# EAGLE design SparkSwitch Small (EAGLE 9.6.2)
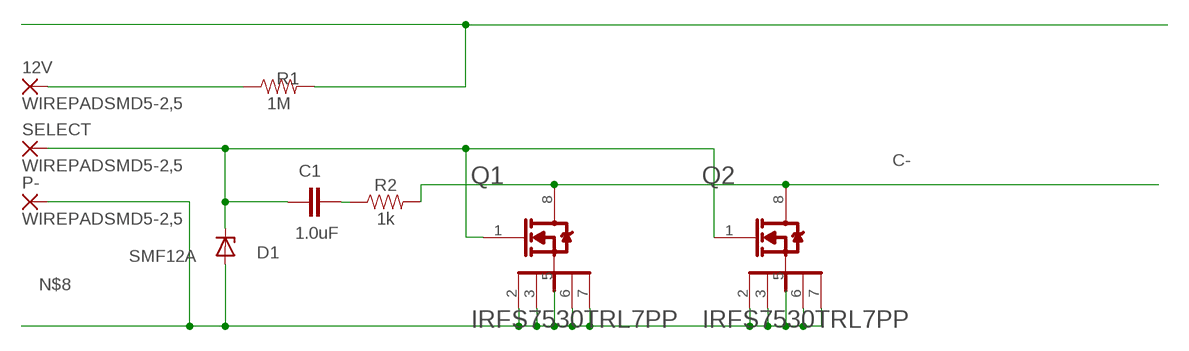
[diagram p0: schematic, sheet 1]

## Parts
12V  WIREPADSMD5-2,5  [5-2,5]
C1  1.0uF  1.0UF-0805-25V-(+80/-20%)  [0805]
D1  SMF12A  [SOD123F]
P-  WIREPADSMD5-2,5  [5-2,5]
Q1  INFINEON_IRFS7530TRL7PPINFINEON_IRFS7530TRL7PP_0_0  [INFINEON_IRFS7530TRL7PP_0]
Q2  INFINEON_IRFS7530TRL7PPINFINEON_IRFS7530TRL7PP_0_0  [INFINEON_IRFS7530TRL7PP_0]
R1  1M  1MOHM-0603-1/4W-5%  [0603]
R2  1k  1KOHM-0603-1/10W-1%  [0603]
SELECT  WIREPADSMD5-2,5  [5-2,5]

## Nets
C-: Q1.8(D) Q2.8(D) R2.2
N$3 [Therm]: C1.1 D1.C Q1.1(G) Q2.1(G) SELECT.1(P)
N$4 [Therm]: C1.2 R2.1
N$5 [Therm]: R1.2
N$6 [Therm]: 12V.1(P) R1.1
N$8 [Therm]: D1.A P-.1(P) Q1.2(1_S) Q1.3(2_S) Q1.5(3_S) Q1.6(4_S) Q1.7(5_S) Q2.2(1_S) Q2.3(2_S) Q2.5(3_S) Q2.6(4_S) Q2.7(5_S)

## Library data of the parts
12V P- SELECT = wirepad:WIREPAD: Wire PAD connect wire on PCB
C1 = SparkFun-Capacitors:1.0UF: 1µF ceramic capacitors A capacitor is a passive two-terminal electrical component used to store electrical energy temporarily in an electric field.; PROD_ID: CAP-11625
D1 = smf_10:SMF*A: SMF Series TVS Diodes Source: http://www.littelfuse.com/~/media/electronics/datasheets/tvs_diodes/littelfuse_tvs_diode_smf_datasheet.pdf.pdf; MF: Littelfuse; MPN: SMF12A; OC_FARNELL: unknown; OC_NEWARK: unknown
Q1 Q2 = Infineon - IRFS7530TRL7PP:INFINEON_IRFS7530TRL7PP: N-Channel 60V 240A (Tc) 375W (Tc) Surface Mount D2PAK (7-Lead); AUTOMOTIVE: No; CENTROID_NOT_SPECIFIED: Yes; CONTINUOUS_DRAIN_CURRENT: 240A; DATASHEET: https://www.infineon.com/dgdl/irfs7530-7ppbf.pdf?fileId=5546d462533600a40153563a9d1e21d8; DEPLETION_MODE: False; DEVICE_CLASS_L1: Discrete Semiconductors; DEVICE_CLASS_L2: Transistors; DEVICE_CLASS_L3: MOSFETs; DIGIKEY_DESCRIPTION: MOSFET N CH 60V 240A D2PAK; DIGIKEY_PART_NUMBER: IRFS7530TRL7PPCT-ND; DRAIN_TO_SOURCE_BREAKDOWN_VOLTAGE: 60V; DRAIN_TO_SOURCE_RESISTANCE: 1.15mΩ; DRAIN_TO_SOURCE_VOLTAGE: 60V; FOOTPRINT_URL: https://www.infineon.com/cms/en/product/packages/PG-TO263/PG-TO263-7-900/; FOOTPRINT_VARIANT_NAME_0: Recommended_Land_Pattern; GATE_CHARGE_AT_VGS: 236nC @ 10V; GATE_TO_SOURCE_VOLTAGE: 20V; HEIGHT: 5.084mm; INPUT_CAPACITACE_AT_VDS: 12960pF @ 25V; LEAD_FREE: Yes; MAX_FORWARD_DIODE_VOLTAGE: 1.2V; MAX_JUNCTION_TEMP: +175°C; MF: Infineon; MFG_PACKAGE_IDENT: PG-TO263-7; MFG_PACKAGE_IDENT_COMPONENT_ID: 97dda32f29e91852; MFG_PACKAGE_IDENT_DATE: 0; MFG_PACKAGE_IDENT_REV: 900; MOUSER_PART_NUMBER: 942-IRFS7530TRL7PP; MPN: IRFS7530TRL7PP; NUMBER_OF_CHANNELS: 1; NUMBER_OF_N_CHANNELS: 1; PACKAGE: D2PAK7P; POWER_DISSIPATION: 375W; PREFIX: Q; PULSE_DRAIN_CURRENT: 1450A; REVERSE_RECOVERY_CHARGE: 72nC; REVERSE_RECOVERY_TIME: 48ns; ROHS: Yes; RTHJA_MAX: 40°C/W; STANDOFF_HEIGHT: 0mm; TECHNOLOGY: MOSFET; TEMPERATURE_RANGE_HIGH: +175°C; TEMPERATURE_RANGE_LOW: -55°C; THRESHOLD_VGS: 2.1-3.7V; THRESHOLD_VGS_MAX: 3.7V; THRESHOLD_VGS_MIN: 2.1V; TURN_OFF_DELAY_TIME: 168ns; TURN_ON_DELAY_TIME: 24ns; VERIFICATION_VERSION: 0.0.0.3
R1 = SparkFun-Resistors:1MOHM: 1MΩ resistor A resistor is a passive two-terminal electrical component that implements electrical resistance as a circuit element. Resistors act to reduce current flow, and, at the same time, act to lower voltage levels within circuits. - Wikipedia; PROD_ID: RES-07868
R2 = SparkFun-Resistors:1KOHM: 1kΩ resistor A resistor is a passive two-terminal electrical component that implements electrical resistance as a circuit element. Resistors act to reduce current flow, and, at the same time, act to lower voltage levels within circuits. - Wikipedia; PROD_ID: RES-07856

## Board
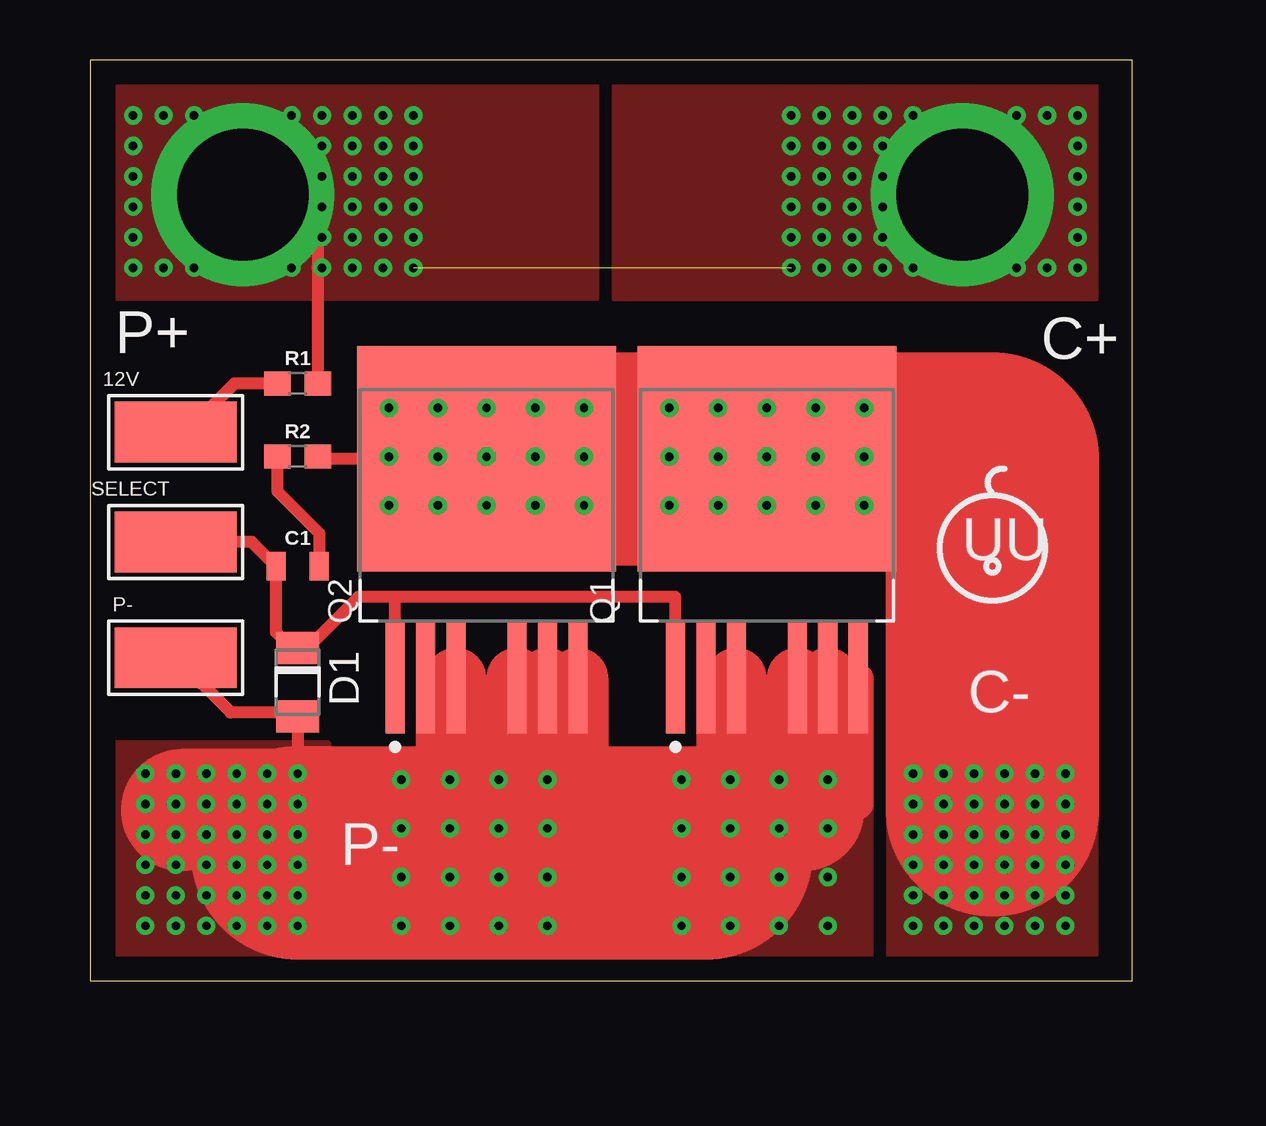
[diagram p1: board, top side]
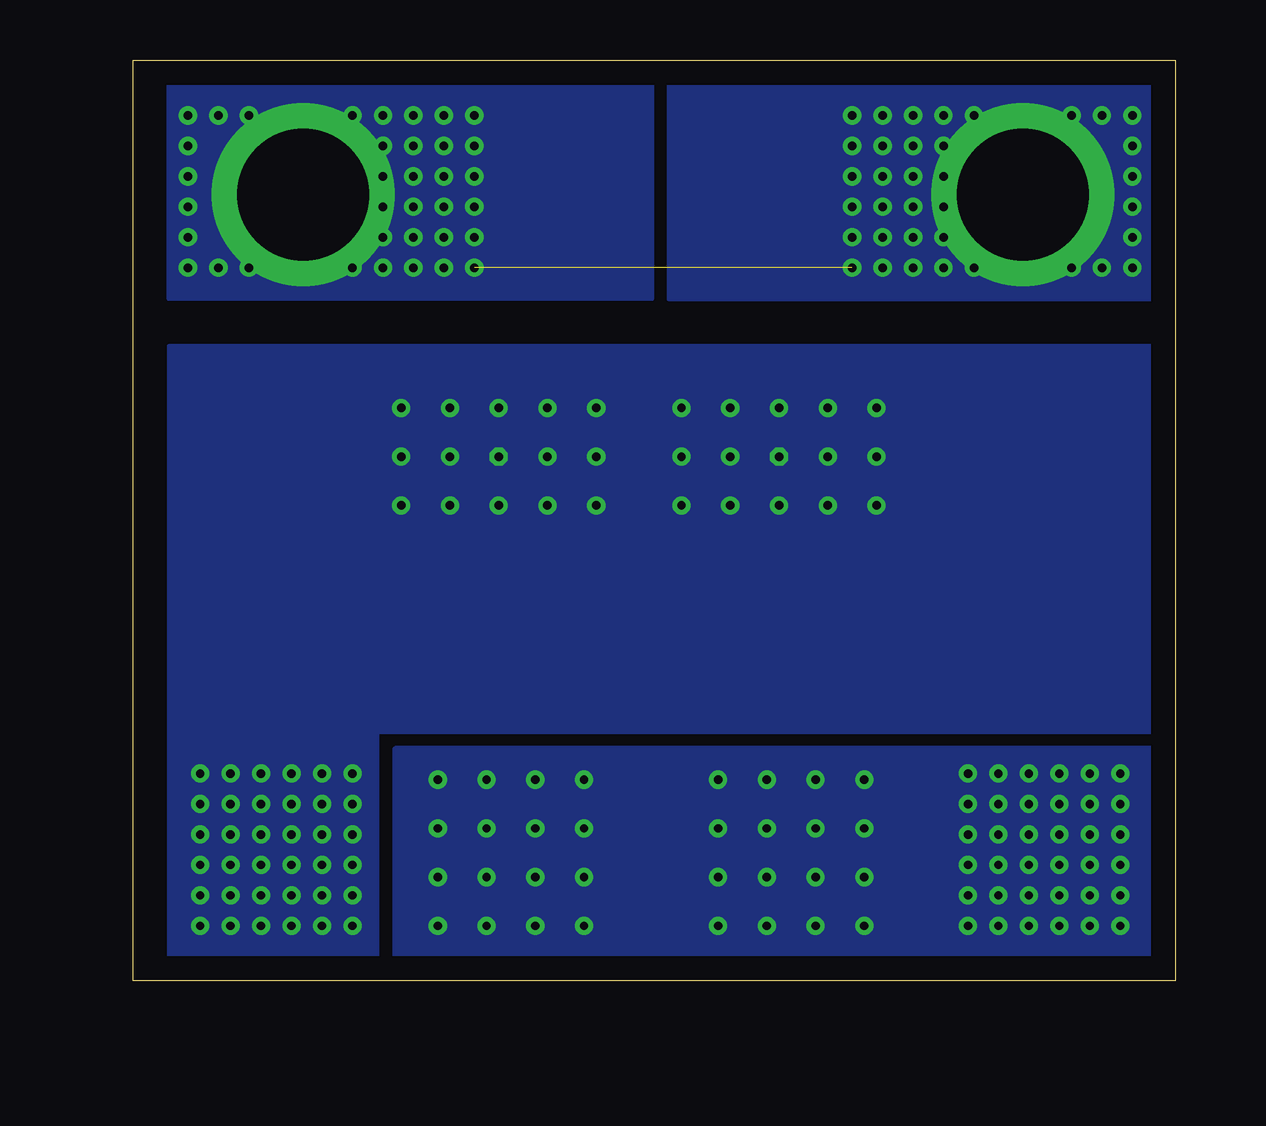
[diagram p2: board, bottom side, seen from below]

Size 43.43 x 38.38 mm. Coordinates in mm from the lower left corner, seen from the top.
Outline: 0,0 43.43,0 43.43,38.38 0,38.38 0,0
Copper layers (1*16): Top 0.035mm / dielectric 1.5mm / Bottom 0.035mm
Design rules "default": minimum track width 6mil, minimum drill 0.35mm, track to track 6mil, track to pad 6mil, pad to pad 6mil, via to via 6mil, smd to smd 6mil, copper to edge 40mil, drill to drill 6mil, minimum pad ring 10mil, minimum via ring 8mil, stop-mask expansion 4mil, vias tented up to drill 0mil, thermal gap 10mil

### Footprints (pad centres in the part's own frame; a part is rotated, then mirrored left to right if it is on the bottom)
5-2,5 = smd 2.54 x 5.08: 1 0,0
0805 = smd 0.8 x 1.2: 1 -0.9,0; 2 0.9,0
SOD123F = smd 1.34 x 1.8: A 1.43,0; C -1.43,0
INFINEON_IRFS7530TRL7PP_0 = smd 0.8 x 4.6: 1 -3.81,-7.21; 2 -2.54,-7.21; 3 -1.27,-7.21; 5 1.27,-7.21; 6 2.54,-7.21; 7 3.81,-7.21 | smd 10.8 x 9.4: 8 0,1.94 | smd 0.7 x 4.5: SMD_7 -3.81,-7.21; SMD_8 -2.54,-7.21; SMD_9 -1.27,-7.21; SMD_10 1.27,-7.21; SMD_11 2.54,-7.21; SMD_12 3.81,-7.21 | smd 5.2 x 4.5: SMD_14 -2.75,4.34; SMD_15 2.75,4.34; SMD_16 -2.75,-0.46; SMD_17 2.75,-0.46
0603 = smd 1.1 x 1: 1 -0.85,0; 2 0.85,0

### Placement (x,y rotation side)
12V  3.56,22.86 90 top
C1  8.64,17.27 0 top
D1  8.64,12.45 270 top
P-  3.56,13.46 90 top
Q1  28.19,19.81 0 top
Q2  16.51,19.81 0 top
R1  8.64,24.89 0 top
R2  8.64,21.84 0 top
SELECT  3.56,18.29 90 top

### Tracks (layer width: path | path; a pad name or v marks a point on that pad's centre or on a via)
C-  (via drill 0.35)
  Top 0.508: R2.2 9.49,21.75 Q2.8 | 35.81,21.75 34,21.75
  Top 8.89: Q2.8 Q1.8 35.81,21.75 37.59,21.75 37.59,7.11
  other vias: 28.19,21.84 16.51,21.84 26.16,21.84 26.16,19.81 28.19,19.81 30.23,19.81 30.23,21.84 30.23,23.88 28.19,23.88 26.16,23.88 18.54,21.84 18.54,19.81 16.51,19.81 14.48,19.81 14.48,21.84 14.48,23.88 16.51,23.88 18.54,23.88 12.45,21.84 12.45,23.88 12.45,19.81 20.57,19.81 20.57,21.84 20.57,23.88 24.13,23.88 24.13,21.84 24.13,19.81 32.26,23.88 32.26,21.84 32.26,19.81 34.29,8.64 34.29,6.1 38.1,7.37 36.83,4.83 35.56,6.1 36.83,6.1 38.1,6.1 34.29,4.83 38.1,4.83 35.56,4.83 38.1,8.64 35.56,7.37 35.56,8.64 36.83,8.64 34.29,7.37 36.83,7.37 34.29,3.56 34.29,2.29 35.56,3.56 35.56,2.29 36.83,3.56 36.83,2.29 38.1,2.29 38.1,3.56 39.37,2.29 40.64,2.29 40.64,3.56 39.37,3.56 39.37,4.83 39.37,6.1 40.64,4.83 40.64,6.1 39.37,7.37 40.64,7.37 40.64,8.64 39.37,8.64
  pour Top: 41.91,1.02 41.91,9.65 33.27,9.65 33.27,1.02
  pour Bottom (isolate 0.254): 1.02,26.42 41.91,26.42 41.91,1.02 33.27,1.02 33.27,10.41 1.02,10.41
N$3
  Top 0.254: D1.C 8.8,13.72
  Top 0.508: SELECT.1 6.72,18.29 C1.1 7.74,14.52 8.38,13.88 D1.C 8.64,13.46 11.18,16 12.7,16 | Q2.1 12.7,16 | Q1.1 24.38,16 12.7,16
N$4
  Top 0.508: R2.1 7.79,20.41 9.54,18.66 C1.2
N$5  (via drill 0.35, 5.49 pad 7.62)  (1 unrouted)
  Top 0.254: 3.81,32.77 9.49,32.77
  Top 0.508: R1.2 9.49,32.77
  other vias: 1.78,33.53 1.78,32.26 1.78,30.99 1.78,29.72 3.05,29.72 9.65,29.72 10.92,29.72 10.92,30.99 9.65,30.99 4.32,29.72 8.38,29.72 9.65,32.26 10.92,32.26 10.92,33.53 9.65,33.53 8.38,36.07 29.21,33.53 30.48,33.53 31.75,33.53 33.02,33.53 33.02,32.26 33.02,30.99 33.02,29.72 29.21,29.72 29.21,30.99 29.21,32.26 30.48,32.26 30.48,30.99 30.48,29.72 31.75,29.72 31.75,30.99 31.75,32.26 29.21,34.8 29.21,36.07 33.02,36.07 39.88,36.07 34.29,36.07 41.15,34.8 41.15,36.07 41.15,33.53 41.15,32.26 41.15,30.99 41.15,29.72 39.88,29.72 34.29,29.72 38.61,36.07 31.75,34.8 33.02,34.8 38.61,29.72 30.48,34.8 30.48,36.07 31.75,36.07 1.78,36.07 3.05,36.07 9.65,36.07 10.92,36.07 12.19,36.07 13.46,36.07 1.78,34.8 4.32,36.07 9.65,34.8 10.92,34.8 12.19,34.8 12.19,33.53 12.19,32.26 12.19,30.99 12.19,29.72 13.46,34.8 13.46,33.53 13.46,32.26 13.46,30.99 13.46,29.72 6.35,32.77 36.35,32.77
  pour Top: 21.84,37.34 21.84,28.45 41.91,28.45 41.91,37.34
  pour Top: 1.02,37.34 21.08,37.34 21.08,28.45 1.02,28.45
  pour Bottom (isolate 0.254): 1.02,37.34 21.08,37.34 21.08,28.45 1.02,28.45
  pour Bottom (isolate 0.254): 21.84,37.34 21.84,28.45 41.91,28.45 41.91,37.34
N$6
  Top 0.508: R1.1 6.01,24.89 3.98,22.86 12V.1
N$8  (via drill 0.35)
  Top 0.254: 8.8,11.02 D1.A
  Top 0.508: P-.1 5.84,11.18 8.48,11.18 D1.A 8.64,7.11 8.64,5.33 | Q2.2 14.22,12.35
  Top 0.813: 30.73,7.11 29.72,7.11 | Q1.2 25.65,7.11 25.65,5.33 | v19.05,8.38 19.05,5.33 | Q2.2 13.97,5.33 | v30.73,8.38 30.73,7.11 | 30.73,7.11 31.75,7.11 32,7.37
  Top 1.27: Q1.7 32,7.37
  Top 2.54: Q1.5 29.46,7.11 | Q1.3 26.92,7.11 | Q2.7 20.32,5.33 | Q2.6 v19.05,8.38 | Q2.5 17.78,5.33 | Q2.3 15.24,5.33 | Q1.6 v30.73,8.38
  Top 5.08: 8.64,7.11 3.81,7.11 | 25.65,7.11 26.92,7.11 29.46,7.11 29.72,7.11
  Top 8.89: 8.64,5.33 13.97,5.33 15.24,5.33 17.78,5.33 19.05,5.33 20.32,5.33 25.65,5.33
  other vias: 6.1,7.37 3.56,4.83 4.83,4.83 2.29,4.83 2.29,6.1 3.56,6.1 4.83,6.1 6.1,6.1 4.83,7.37 3.56,7.37 2.29,7.37 6.1,8.64 4.83,8.64 3.56,8.64 2.29,8.64 6.1,4.83 24.64,6.35 26.67,6.35 28.7,6.35 26.67,8.38 28.7,8.38 30.73,6.35 24.64,8.38 19.05,6.35 17.02,6.35 14.99,6.35 12.95,6.35 12.95,8.38 14.99,8.38 17.02,8.38 2.29,3.56 2.29,2.29 3.56,3.56 3.56,2.29 4.83,3.56 4.83,2.29 6.1,3.56 6.1,2.29 7.37,8.64 8.64,8.64 8.64,7.37 12.95,4.32 12.95,2.29 8.64,6.1 7.37,7.37 7.37,6.1 7.37,4.83 8.64,4.83 7.37,3.56 8.64,3.56 7.37,2.29 8.64,2.29 19.05,2.29 19.05,4.32 17.02,4.32 14.99,4.32 14.99,2.29 17.02,2.29 30.73,4.32 30.73,2.29 28.7,2.29 28.7,4.32 26.67,4.32 26.67,2.29 24.64,4.32 24.64,2.29
  pour Top: 1.02,9.91 9.91,9.91 9.91,1.02 1.02,1.02
  pour Bottom (isolate 0.254): 1.02,9.65 32.51,9.65 32.51,1.02 1.02,1.02
  pour Top (isolate 0.254): 32.51,1.02 23.62,1.02 23.62,9.65 32.51,9.65

### Text on the board
tNames: P+ | C+ | UU | C- | P-